# EAGLE design S2 Mini Benchtop Test Board (EAGLE 9.6.2)
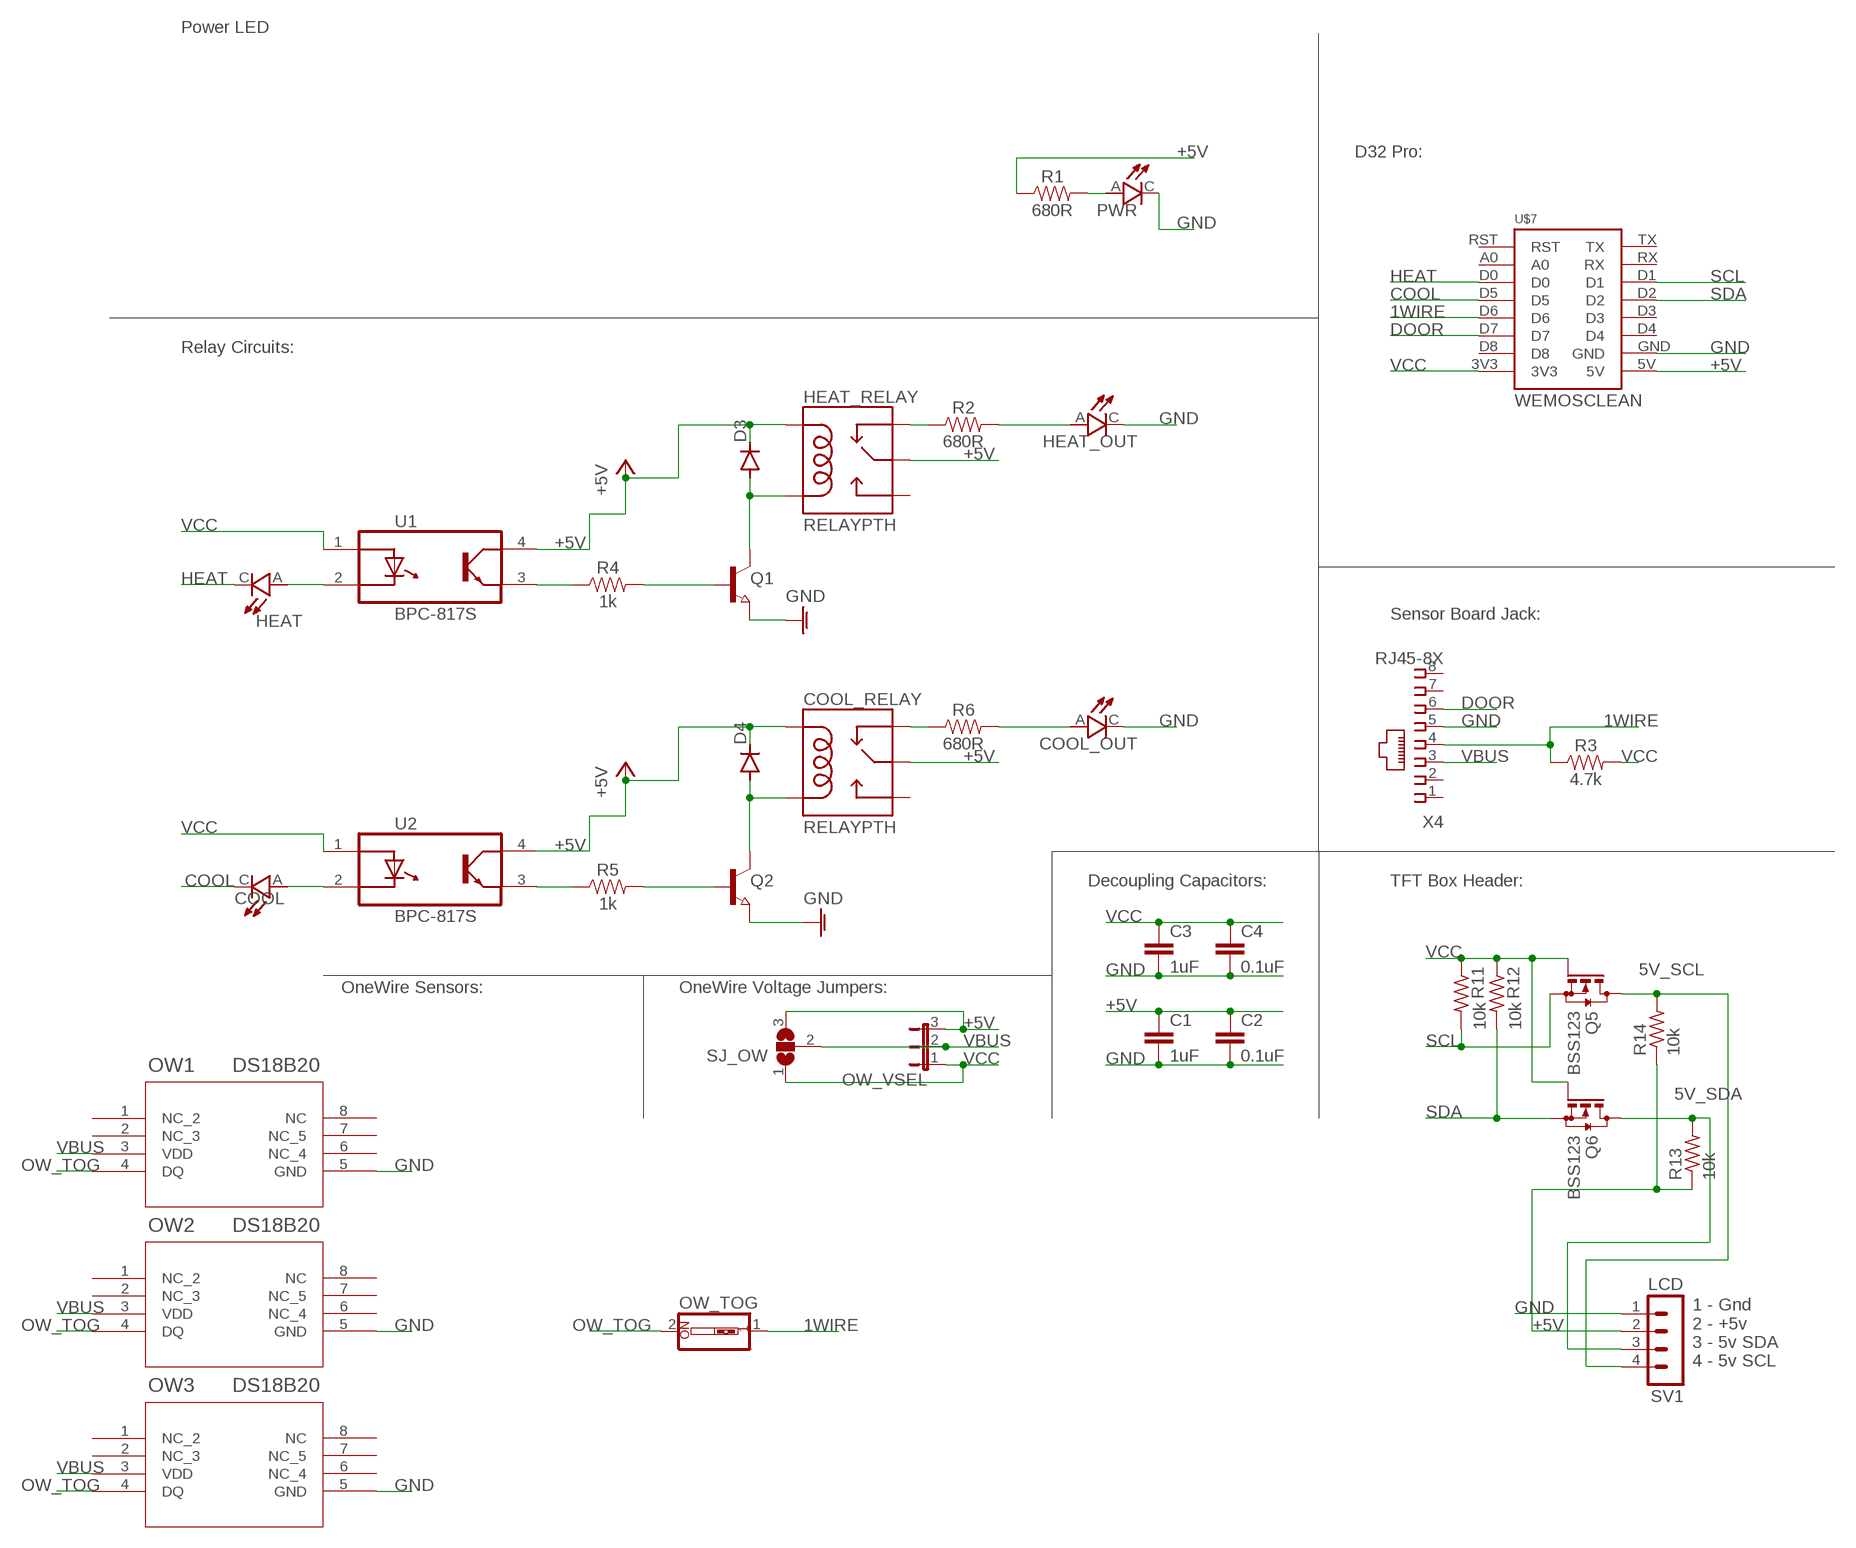
[diagram p0: schematic, sheet 1]

## Parts
C1  1uF  CAP_SMD0805  [SMD-0805]
C2  0.1uF  CAP_SMD0805  [SMD-0805]
C3  1uF  CAP_SMD0805  [SMD-0805]
C4  0.1uF  CAP_SMD0805  [SMD-0805]
COOL  LED_0603LED_SMD_0603  [LED_SMD_0603]
COOL_OUT  LED_0603LED_SMD_0603  [LED_SMD_0603]
COOL_RELAY  RELAYPTH  [SRD-05VDC-SL-C]
D3  DIODE-DO214AC  [DO214AC]
D4  DIODE-DO214AC  [DO214AC]
HEAT  LED_0603LED_SMD_0603  [LED_SMD_0603]
HEAT_OUT  LED_0603LED_SMD_0603  [LED_SMD_0603]
HEAT_RELAY  RELAYPTH  [SRD-05VDC-SL-C]
OW1  DS18B20  DS18B20Z+T&R  [21-0041B_8_MXM]
OW2  DS18B20  DS18B20Z+T&R  [21-0041B_8_MXM]
OW3  DS18B20  DS18B20Z+T&R  [21-0041B_8_MXM]
OW_TOG  SW_DIP-1  [EDG-01]
OW_VSEL  JP2ENOLABEL  [JP2-NOLABEL]
PWR  LED_0603LED_SMD_0603  [LED_SMD_0603]
Q1  NPN-TRANSISTOR_SOT23  [SOT23]
Q2  NPN-TRANSISTOR_SOT23  [SOT23]
Q5  BSS123  [SOT23]
Q6  BSS123  [SOT23]
R1  680R  RES_SMD0805  [SMD-0805]
R2  680R  RES_SMD0805  [SMD-0805]
R3  4.7k  RES_SMD0805  [SMD-0805]
R4  1k  RES_SMD0805  [SMD-0805]
R5  1k  RES_SMD0805  [SMD-0805]
R6  680R  RES_SMD0805  [SMD-0805]
R11  10k  R-US_R0805  [R0805]
R12  10k  R-US_R0805  [R0805]
R13  10k  R-US_R0805  [R0805]
R14  10k  R-US_R0805  [R0805]
SJ_OW  SJ2W  [SJ_2]
SV1  LCD  HDR-4  [HDR-4_VERT]
U1  BPC-817S  [SOIC127P700X210-4N]
U2  BPC-817S  [SOIC127P700X210-4N]
U$7  WEMOSCLEAN  [WEMOS-CLEAN]
X4  RJ45-8X  [RJ45-NO-SHIELD]

## Nets
1WIRE: OW_TOG.1 R3.1 U$7.D6 X4.4
5V_SCL: Q5.3(D) R14.2 SV1.4
5V_SDA: Q6.3(D) R13.2 SV1.3
+5V: C1.1 C2.1 COOL_RELAY.COIL1 COOL_RELAY.SWCOMMON D3.C D4.C HEAT_RELAY.COIL1 HEAT_RELAY.SWCOMMON OW_VSEL.3 R1.1 R13.1 R14.1 SJ_OW.3 SV1.2 U1.4(CO) U2.4(CO) U$7.5V
COOL: COOL.C U$7.D5
DOOR: U$7.D7 X4.6
GND: C1.2 C2.2 C3.2 C4.2 COOL_OUT.C HEAT_OUT.C OW1.5(GND) OW2.5(GND) OW3.5(GND) PWR.C Q1.2(E) Q2.2(E) SV1.1 U$7.GND X4.5 ; supply symbol labelled GNDA
HEAT: HEAT.C U$7.D0
N$1: Q1.1(B) R4.2
N$3: PWR.A R1.2
N$4: R4.1 U1.3(E)
N$5: COOL_RELAY.COIL0 D4.A Q2.3(C)
N$6: R5.1 U2.3(E)
N$7: Q2.1(B) R5.2
N$8: COOL_RELAY.SWCLOSED(SWCLOSE) R6.1
N$9: COOL_OUT.A R6.2
N$10: HEAT_OUT.A R2.2
N$11: HEAT_RELAY.SWCLOSED(SWCLOSE) R2.1
N$12: HEAT.A U1.2(C)
N$14: D3.A HEAT_RELAY.COIL0 Q1.3(C)
N$16: COOL.A U2.2(C)
OW_TOG: OW1.4(DQ) OW2.4(DQ) OW3.4(DQ) OW_TOG.2
SCL: Q5.2(S) R11.2 U$7.D1
SDA: Q6.2(S) R12.2 U$7.D2
VBUS: OW1.3(VDD) OW2.3(VDD) OW3.3(VDD) OW_VSEL.2 SJ_OW.2 X4.3
VCC: C3.1 C4.1 OW_VSEL.1 Q5.1(G) Q6.1(G) R3.2 R11.1 R12.1 SJ_OW.1 U1.1(A) U2.1(A) U$7.3V3
Unconnected: COOL_RELAY.SWOPEN HEAT_RELAY.SWOPEN OW1.1(NC_2) OW1.2(NC_3) OW1.6(NC_4) OW1.7(NC_5) OW1.8(NC) OW2.1(NC_2) OW2.2(NC_3) OW2.6(NC_4) OW2.7(NC_5) OW2.8(NC) OW3.1(NC_2) OW3.2(NC_3) OW3.6(NC_4) OW3.7(NC_5) OW3.8(NC) U$7.A0 U$7.D3 U$7.D4 U$7.D8 U$7.RST U$7.RX U$7.TX X4.1 X4.2 X4.7 X4.8

## Notes on the sheet
- Power LED
- D32 Pro:
- Relay Circuits:
- Sensor Board Jack:
- Decoupling Capacitors: | TFT Box Header:
- OneWire Sensors: | OneWire Voltage Jumpers:
- 1 - Gnd
  2 - +5v
  3 - 5v SDA
  4 - 5v SCL

## Library data of the parts
C1 C3 = Donnie:CAP_SMD; LCSC_PART: C28323
C2 C4 = Donnie:CAP_SMD; LCSC_PART: C49678
COOL COOL_OUT HEAT HEAT_OUT PWR = Donnie:LED_0603: RED CHIP LED MINI-MOLD Check availability <https://pricing.snapeda.com/parts/SML-D12U1WT86/Rohm/view-part?ref=eda>; DESCRIPTION: Red 620nm LED Indication - Discrete 2.2V 0603 (1608 Metric); LCSC_PART: C2286; PACKAGE: 0603 Rohm
COOL_RELAY HEAT_RELAY = SRD-05VDC-SL-C:RELAY: SPDT relay (COM-00101); JLC_X: -0.3; JLC_Y: -0.2; LCSC_PART: C35449
D3 D4 = diode:DIODE-: DIODE; LCSC_PART: C95872
OW1-OW3 = Donnie:DS18B20Z+T&R; COPYRIGHT: Copyright (C) 2024 Ultra Librarian. All rights reserved.; JLC_R: -90; LCSC_PART: C695837; MANUFACTURER_PART_NUMBER: DS18B20Z+T&R; MFR_NAME: Analog Devices / Maxim Integrated
OW_TOG = special:SW_DIP-1: DIP SWITCH; LCSC_PART: C126888
OW_VSEL = Donnie:JP2E: JUMPER; LCSC_PART: C2937625
Q1 Q2 = semicon-smd-ipc:NPN-TRANSISTOR_: NPN TRANSISTOR; JLC_R: -90; LCSC_PART: C20526
Q5 Q6 = transistor-small-signal:BSS123: N-CHANNEL MOS FET; JLC_R: -90; LCSC_PART: C79015
R1 R2 R6 = Donnie:RES_SMD; LCSC_PART: C17798
R3 = Donnie:RES_SMD; LCSC_PART: C17673
R4 R5 = Donnie:RES_SMD; LCSC_PART: C17513
R11-R14 = rcl:R-US_: RESISTOR, American symbol; LCSC_PART: C17902; SPICEPREFIX: R
SJ_OW = jumper:SJ2W: SMD solder JUMPER
SV1 = Donnie:HDR-4: PIN HEADER; LCSC_PART: C2691448
U1 U2 = Donnie:BPC-817S: Check availability <https://pricing.snapeda.com/parts/VOS618A-7X001T/Vishay/view-part?ref=eda>; LCSC_PART: C106900
U$7 = 1455413453956-wemos:WEMOS: LoLin D1 Mini controller socket
X4 = Box Header:RJ45: CORCOM Modular RJ Jacks No Shield Source: www.tycoelectronics.com .. ENG_DS_1654001_1099_RJ_L_0507.pdf; JLC_Y: 7.55; LCSC_PART: C3000197; MPN: RJ45-8X; OC_FARNELL: unknown; OC_NEWARK: 16R6101

## Net classes
0 default: width 1.016 mm, clearance 0.254 mm
1 AC: width 2.54 mm, clearance 1.2 mm
3 Gnd: width 0.406 mm, clearance 0.406 mm

## Board
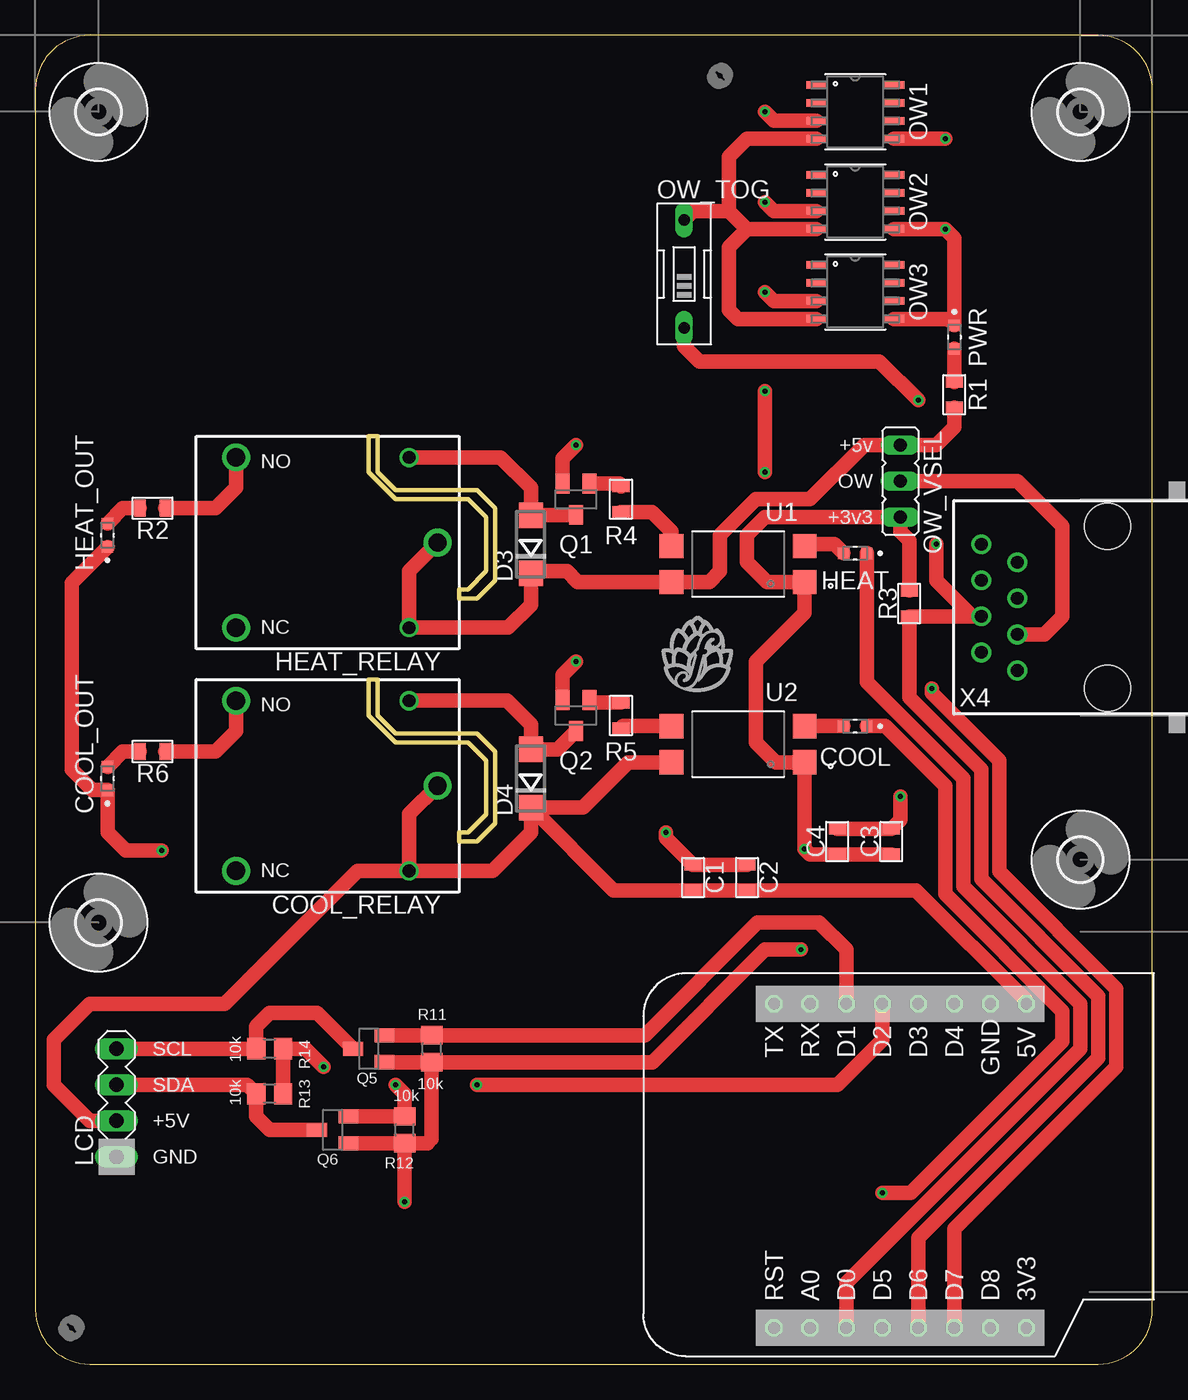
[diagram p1: board, top side]
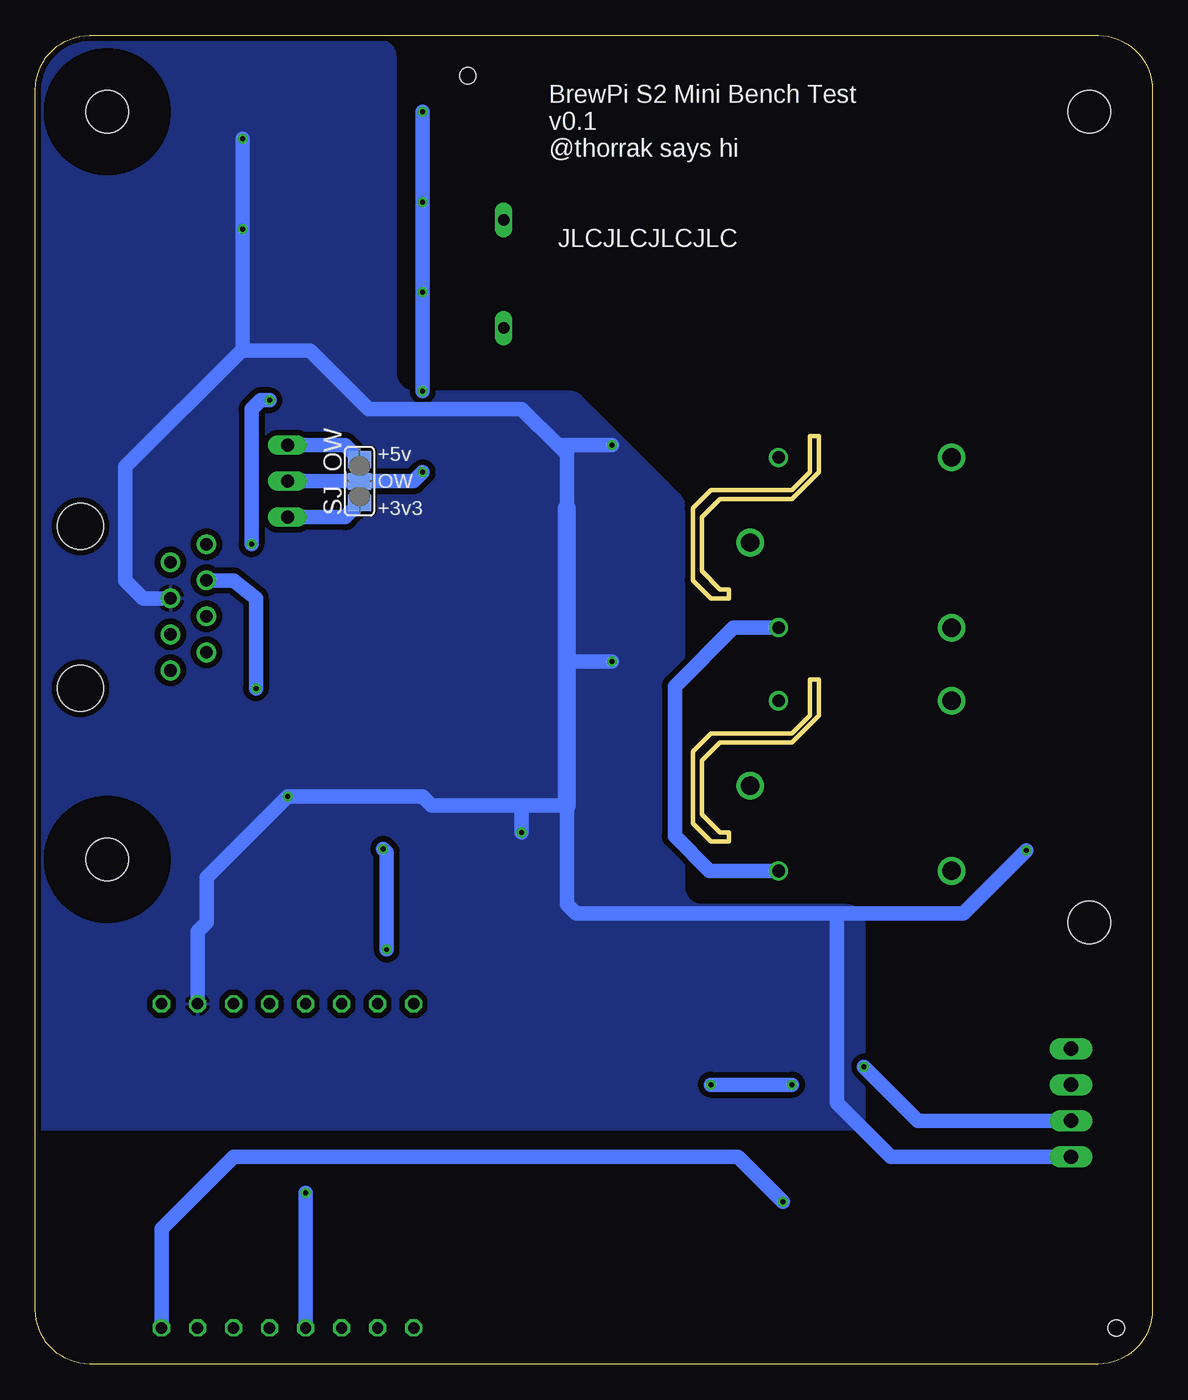
[diagram p2: board, bottom side, seen from below]

Size 78.73 x 93.65 mm. Coordinates in mm from the lower left corner, seen from the top.
Outline: 0,89.84 0,3.81 arc90 3.81,0 74.92,0 arc90 78.73,3.81 78.73,89.84 arc90 74.92,93.65 3.81,93.65 arc90 0,89.84
Outline: 24.13,65.41 24.13,62.87 25.4,61.59 31.11,61.59 32.38,60.32 32.38,55.24 31.11,53.98 29.84,53.98 29.84,54.61 30.48,54.61 31.75,55.88 31.75,59.69 30.48,60.96 25.4,60.96 23.5,62.87 23.5,65.41 24.13,65.41
Outline: 23.5,48.26 24.13,48.26 24.13,45.72 25.4,44.45 31.11,44.45 32.38,43.18 32.38,38.1 31.11,36.83 29.84,36.83 29.84,37.46 30.48,37.46 31.75,38.73 31.75,42.55 30.48,43.81 25.4,43.81 23.5,45.72 23.5,48.26
Copper layers (1*16): Top 0.0356mm / dielectric 1.5011mm / Bottom 0.0356mm
Design rules "PCBs_io": minimum track width 6mil, minimum drill 13mil, track to track 6mil, track to pad 6mil, pad to pad 6mil, via to via 6mil, smd to smd 6mil, copper to edge 15mil, drill to drill 6mil, minimum pad ring 7mil, minimum via ring 7mil, stop-mask expansion 3mil, vias tented up to drill 0mil, thermal gap 10mil

### Footprints (pad centres in the part's own frame; a part is rotated, then mirrored left to right if it is on the bottom)
SMD-0805 = smd 0.8 x 1.2: 1 -0.9,0; 2 0.9,0
LED_SMD_0603 = smd 0.8 x 0.8: A 0.825,0; C -0.825,0
SRD-05VDC-SL-C = drill 0.9: COIL0 -5.39,-6.12; COIL1 -5.39,5.88 | drill 1.3: SWCLOSED 6.81,-6.12; SWCOMMON -7.39,-0.12; SWOPEN 6.81,5.88
DO214AC = smd 1.8 x 1.7: A 2.05,0; C -2.05,0
21-0041B_8_MXM = smd 1.46 x 0.533: 1 -2.724,1.905; 2 -2.724,0.635; 3 -2.724,-0.635; 4 -2.724,-1.905; 5 2.724,-1.905; 6 2.724,-0.635; 7 2.724,0.635; 8 2.724,1.905
EDG-01 = drill 0.813 long: 1 0,-3.81; 2 0,3.81
JP2-NOLABEL = drill 0.914 long: 1 -2.54,0; 2 0,0; 3 2.54,0
SOT23 = smd 1 x 1.4: 1 -0.95,-1.1; 2 0.95,-1.1; 3 0,1.1
R0805 = smd 1.3 x 1.5: 1 -0.95,0; 2 0.95,0
SJ_2 = smd 1.168 x 1.6: 1 -1.524,0; 2 0,0; 3 1.524,0
HDR-4_VERT = drill 1.016 long: 1 0,0; 2 2.54,0; 3 5.08,0; 4 7.62,0
SOIC127P700X210-4N = smd 1.68 x 1.71: 1 -4.692,1.27; 2 -4.692,-1.27; 3 4.692,-1.27; 4 4.692,1.27
3,0 = hole 3: 0,0
1.152 = hole 1.152: 0,0
WEMOS-CLEAN = drill 0.8 octagon: 3V3 0,0; 5V 22.86,0; A0 0,15.24; D0 0,12.7; D1 22.86,12.7; D2 22.86,10.16; D3 22.86,7.62; D4 22.86,5.08; D5 0,10.16; D6 0,7.62; D7 0,5.08; D8 0,2.54; GND 22.86,2.54; RST 0,17.78; RX 22.86,15.24; TX 22.86,17.78
RJ45-NO-SHIELD = drill 0.9 pad 1.4: 1 -4.445,6.35; 2 -3.175,8.89; 3 -1.905,6.35; 4 -0.635,8.89; 5 0.635,6.35; 6 1.905,8.89; 7 3.175,6.35; 8 4.445,8.89 | hole 3.251: -5.715,0; 5.715,0

### Placement (x,y rotation side)
C1  46.35,34.29 90 top
C2  50.16,34.29 90 top
C3  60.32,36.83 90 top
C4  56.51,36.83 90 top
COOL  57.78,44.96 180 top
COOL_OUT  5.08,41.27 90 top
COOL_RELAY  20.96,40.64 180 top
D3  34.92,57.79 90 top
D4  34.92,41.27 90 top
HEAT  57.78,57.15 180 top
HEAT_OUT  5.08,58.42 90 top
HEAT_RELAY  20.96,57.79 180 top
OW1  57.78,88.27 0 top
OW2  57.78,81.92 0 top
OW3  57.78,75.57 0 top
OW_TOG  45.72,76.84 0 top
OW_VSEL  60.96,62.23 90 top
PWR  64.77,72.39 270 top
Q1  38.1,60.96 180 top
Q2  38.1,45.72 180 top
Q5  23.5,22.23 90 top
Q6  20.96,16.51 90 top
R1  64.77,68.33 90 top
R2  8.26,60.32 180 top
R3  61.59,53.61 90 top
R4  41.27,60.96 90 top
R5  41.27,45.72 90 top
R6  8.26,43.18 180 top
R11  27.94,22.23 90 top
R12  26.04,16.51 90 top
R13  16.51,19.05 180 top
R14  16.51,22.23 180 top
SJ_OW  55.88,62.23 90 bottom
SV1  5.71,14.6 90 top
U1  49.53,56.39 180 top
U2  49.53,43.69 180 top
U$1  [3,0]  4.45,88.27 0 top
U$2  [3,0]  4.45,31.12 0 top
U$3  [3,0]  73.66,35.56 0 top
U$4  [3,0]  73.66,88.27 0 top
U$5  [1.152]  2.54,2.54 0 top
U$6  [1.152]  48.26,90.81 0 top
U$7  69.85,2.54 90 top
X4  75.56,53.34 90 top

### Tracks (layer width: path | path; a pad name or v marks a point on that pad's centre or on a via)
1WIRE  (via drill 0.35)
  Top 1.016: 66.04,52.71 R3.1 61.59,46.99 66.67,41.91 66.67,34.18 74.93,25.93 74.93,21.59 62.23,8.89 U$7.D6 | 66.04,52.71 X4.4 | v62.23,67.95 59.51,70.67 46.81,70.67 45.72,71.76 OW_TOG.1 | v63.5,57.79 63.5,55.24 66.04,52.71
  Bottom 1.016: v62.23,67.95 62.87,67.95 63.5,67.31 v63.5,57.79
5V_SCL
  Top 1.016: SV1.4 R14.2 15.56,23.81 16.51,24.77 19.86,24.77 Q5.3
5V_SDA
  Top 1.016: SV1.3 14.93,19.69 R13.2 15.56,17.46 16.51,16.51 Q6.3
+5V  (via drill 0.35)
  Top 1.016: COOL_RELAY.COIL1 32.22,34.76 34.92,37.46 D4.C | COOL_RELAY.COIL1 22.7,34.76 13.34,25.4 3.81,25.4 1.27,22.86 1.27,19.69 3.81,17.15 SV1.2 | U2.4 41.78,42.42 38.59,39.23 D4.C | HEAT_RELAY.SWCOMMON 26.34,55.91 HEAT_RELAY.COIL1 33.33,51.91 34.92,53.5 D3.C 35.07,55.88 37.46,55.88 38.23,55.12 U1.4 47.5,55.12 48.26,55.88 48.26,58.42 50.8,60.96 54.61,60.96 58.42,64.77 OW_VSEL.3 63.5,64.77 64.77,66.04 R1.1 | COOL_RELAY.COIL1 26.34,38.76 COOL_RELAY.SWCOMMON | v20.32,20.95 19.05,22.23 R14.1 R13.1 | D4.C 40.76,33.39 C1.1 C2.1 62.08,33.39 69.85,25.62 U$7.5V
  Bottom 1.016: HEAT_RELAY.COIL1 29.52,51.91 33.65,47.77 33.65,37.21 31.2,34.76 COOL_RELAY.COIL1 | SJ_OW.3 56.9,64.77 OW_VSEL.3 | SV1.2 16.51,17.15 v20.32,20.95
COOL  (via drill 0.35)
  Top 1.016: COOL.C 59.93,44.96 64.14,40.75 64.14,33.13 72.39,24.87 72.39,22.75 61.7,12.06 v59.69,12.06
  Bottom 1.016: U$7.D5 v59.69,12.06
DOOR  (via drill 0.35)
  Top 1.016: v63.18,47.62 63.18,47.31 67.95,42.55 67.95,34.71 76.2,26.45 76.2,20.95 64.77,9.53 U$7.D7
  Bottom 1.016: X4.6 64.77,55.24 63.18,53.98 v63.18,47.62
GND  (via drill 0.35)
  Top 1.016: C4.2 C3.2 60.96,38.37 v60.96,40 | Q1.2 37.15,63.82 v38.1,64.77 | Q2.2 37.15,48.58 v38.1,49.53 | HEAT_OUT.C 2.54,55.05 2.54,41.91 4,40.45 COOL_OUT.C 5.08,37.46 6.35,36.2 v8.89,36.2 | OW1.5 v64.14,86.36 | OW2.5 v64.14,80.01 64.77,79.38 PWR.C 64.33,73.66 OW3.5 | C2.2 C1.2 44.45,37.09 v44.45,37.46
  Bottom 1.016: 41.27,60.32 41.27,64.14 41.91,64.77 | X4.5 71.12,53.98 72.39,55.24 72.39,63.25 64.2,71.43 | 44.45,39.37 41.27,39.37 41.27,32.38 40.64,31.75 22.23,31.75 | 44.45,39.37 50.8,39.37 51.43,40 v60.96,40 66.67,34.29 66.67,31.12 67.31,30.48 U$7.GND | 41.91,64.77 44.45,67.31 55.24,67.31 59.37,71.43 64.2,71.43 | 22.23,31.75 13.34,31.75 v8.89,36.2 | v38.1,64.77 41.91,64.77 | v38.1,49.53 41.27,49.53 | v64.14,86.36 v64.14,80.01 64.14,71.5 64.2,71.43 | v44.45,37.46 44.45,39.37 | SV1.1 18.41,14.6 22.23,18.41 22.23,31.75
  Bottom 1.27: 41.27,39.37 41.27,49.53 41.27,60.32
  pour Bottom (isolate 0.406): 78.74,93.34 54.61,93.34 arc90 53.34,92.08 53.34,69.85 arc-90 52.07,68.58 41.17,68.58 arc45 40.27,68.21 33.39,61.33 arc45 33.02,60.43 33.02,33.66 arc-90 31.75,32.38 21.59,32.38 arc90 20.32,31.12 20.32,16.51 78.74,16.51
HEAT
  Top 1.016: HEAT.C 58.61,48.07 65.41,41.27 65.41,33.66 73.66,25.4 73.66,22.23 57.15,5.71 U$7.D0
N$1
  Top 1.016: R4.2 41.18,62.06 Q1.1
N$3
  Top 1.016: R1.2 PWR.A
N$4
  Top 1.016: U1.3 44.84,58.67 43.45,60.06 R4.1
N$5
  Top 1.016: COOL_RELAY.COIL0 33.25,46.76 34.92,45.09 D4.A 36.8,43.32 Q2.3
N$6
  Top 1.016: U2.3 41.41,44.96 R5.1
N$7
  Top 1.016: R5.2 39.25,46.62 Q2.1
N$8
  Top 1.016: R6.1 12.7,43.18 14.14,44.62 COOL_RELAY.SWCLOSED
N$9
  Top 1.016: COOL_OUT.A 6.16,43.18 R6.2
N$10
  Top 1.016: HEAT_OUT.A 6.16,60.32 R2.2
N$11
  Top 1.016: R2.1 12.7,60.32 14.14,61.77 HEAT_RELAY.SWCLOSED
N$12
  Top 1.016: HEAT.A 56.32,57.79 54.35,57.79 U1.2
N$14
  Top 1.016: HEAT_RELAY.COIL0 32.78,63.9 34.92,61.76 D3.A 35.07,59.69 35.24,59.86 Q1.3
N$16
  Top 1.016: COOL.A U2.2
OW_TOG
  Top 1.016: OW3.4 49.53,73.66 48.89,74.3 48.89,78.74 50.16,80.01 | OW2.4 50.16,80.01 | 48.89,81.28 48.89,85.09 50.16,86.36 OW1.4 | 50.16,80.01 48.89,81.28 | OW_TOG.2 46.35,81.28 48.89,81.28
SCL
  Top 1.016: Q5.2 R11.2 42.97,23.17 50.91,31.12 55.24,31.12 57.15,29.21 U$7.D1
SDA  (via drill 0.35)
  Top 1.016: Q6.2 R12.2 26.04,19.05 v25.4,19.69 | U$7.D2 59.69,22.86 56.51,19.69 v31.11,19.69
  Bottom 1.016: v31.11,19.69 v25.4,19.69
VBUS  (via drill 0.35)
  Top 1.016: OW_VSEL.2 69.22,62.23 72.39,59.05 72.39,52.7 71.12,51.43 X4.3 | OW1.3 52.07,87.63 v51.43,88.27 | OW2.3 52.07,81.28 v51.43,81.92 | OW3.3 52.07,74.93 v51.43,75.57 | v51.43,62.87 v51.43,68.58
  Bottom 1.016: OW_VSEL.2 SJ_OW.2 52.07,62.23 v51.43,62.87 | v51.43,88.27 v51.43,81.92 v51.43,75.57 v51.43,68.58
VCC  (via drill 0.35)
  Top 1.016: R3.2 61.59,58.05 60.96,58.68 OW_VSEL.1 51.43,59.69 50.16,58.42 50.16,56.52 51.56,55.12 U1.1 54.22,52.95 50.8,49.53 50.8,43.81 52.2,42.42 U2.1 v54.22,36.32 54.61,35.93 C4.1 C3.1 | v26.04,11.43 R12.1 | R11.1 43.5,21.27 51.43,29.21 v53.97,29.21 | Q5.1 R11.1 | Q6.1 R12.1 | R12.1 27.62,15.56 27.94,15.88 R11.1
  Bottom 1.016: SJ_OW.1 56.9,59.69 OW_VSEL.1 | U$7.3V3 69.85,9.53 64.77,14.6 29.21,14.6 v26.04,11.43 | v53.97,29.21 53.97,36.07 v54.22,36.32

### Text on the board
tPlace: NO | NC | NO | NC | SCL | SDA | +5V | GND
tNames: +5v | OW | +3v3
bNames: BrewPi S2 Mini Bench Test / v0.1 / @thorrak says hi | JLCJLCJLCJLC | +5v | OW | +3v3